# Altium schematic sheet 2wire.SchDoc
size A4; Organization: Altium Limited; Address1: L3, 12a Rodborough Rd; Address2: Frenchs Forest; Address3: NSW; Address4: Australia 2086; SheetNumber: 1; SheetTotal: 1; Eng: Kin Seto; TitleBlk1Sch: PCBA, ACTIVE ELECTRODE, AMBER; TitleBlk2Sch: 2 Wire Active Electrode; EngDate: Feb 13 2019; RevSch: 01; DocNumberSCH: 650-02728-01
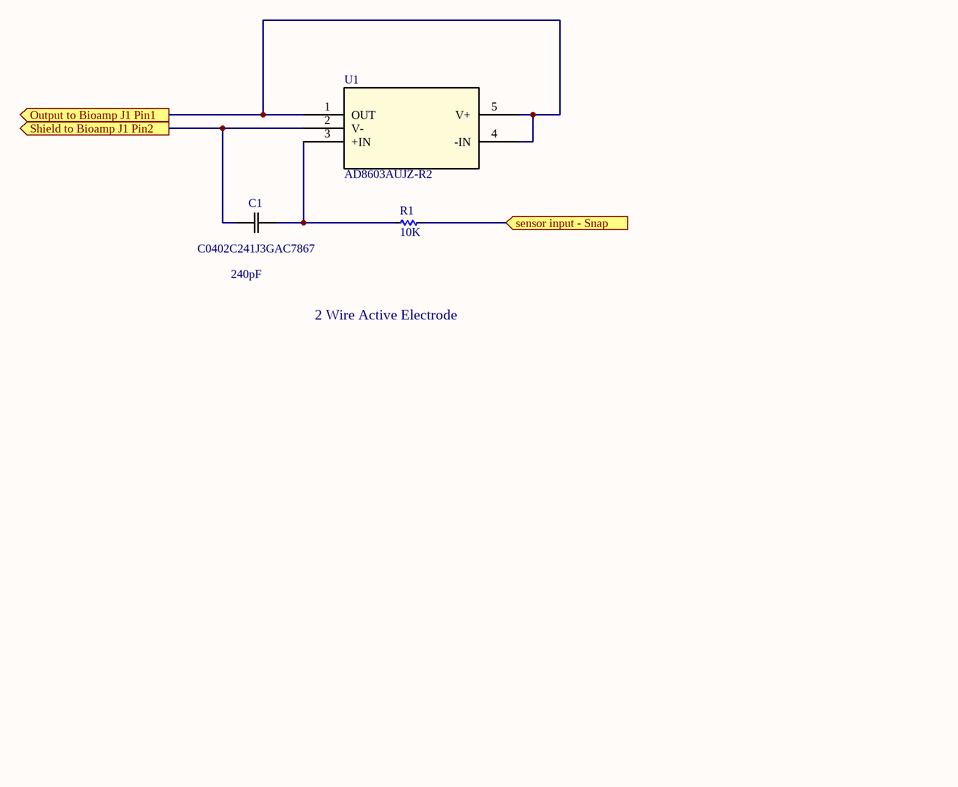
[diagram p0: 2wire.SchDoc]

## Parts
C1  C0402C241J3GAC7867  [G-155]
R1  value 10K  [R0402]
U1  AD8603AUJZ-R2  [UJ_5]

## Ports
Output to Bioamp J1 Pin1 (out), sensor input - Snap (in), Shield to Bioamp J1 Pin2 (out)

## Nets
Output to Bioamp J1 Pin1: U1.1(OUT) U1.4(-IN) U1.5(V+) ; port Output to Bioamp J1 Pin1
sensor input - Snap: R1.2 ; port sensor input - Snap
Shield to Bioamp J1 Pin2: C1.1 U1.2(V-) ; port Shield to Bioamp J1 Pin2
NetC1_2: C1.2 R1.1 U1.3(+IN)

## Notes on the sheet
- (near C1) 240pF
- 2 Wire Active Electrode
- Title:
- USA
- 100 Mayfield Avenue
- Mountain View, CA 94043
- Variant Name:
- Confidential and Proprietary
- Engineer:
- Date:
- Size:
- A4
- Template:
- 992-00283-00 A
- Dwg No:
- Sheet:
- Rev:
- of

## Library data of the parts
C1 = C0402C241J3GAC7867 - 240pf: Imported; Vendor: KEMET; Value: 240pF; Manufacturer_Part_Number: C0402C241J3GAC7867
R1 = 8355: RES, 10K, 0.1%, 1/16W, 0402; ID: 8355; MFG: PANASONIC; MFG P/N: ERA-2AEB103X; COMMON: 470-02401-00; PROXY: Use ID #8534; Status: Released; Package: 0402; Power: 1/16W; Tolerance: 0.1%; LOON: 470-02401-00; Gecko: 470-02401-00; XPN: 470-02401-00
U1 = AD8603AUJZ-R2: No Description Available; Vendor: Analog Devices Inc; Built_By: Analog_Devices_Team; Manufacturer_Part_Number: AD8603AUJZ-R2; Copyright: Copyright (C) 2018 Accelerated Designs. All rights reserved; RefDes: RefDes; Type: DEV; Value: Value